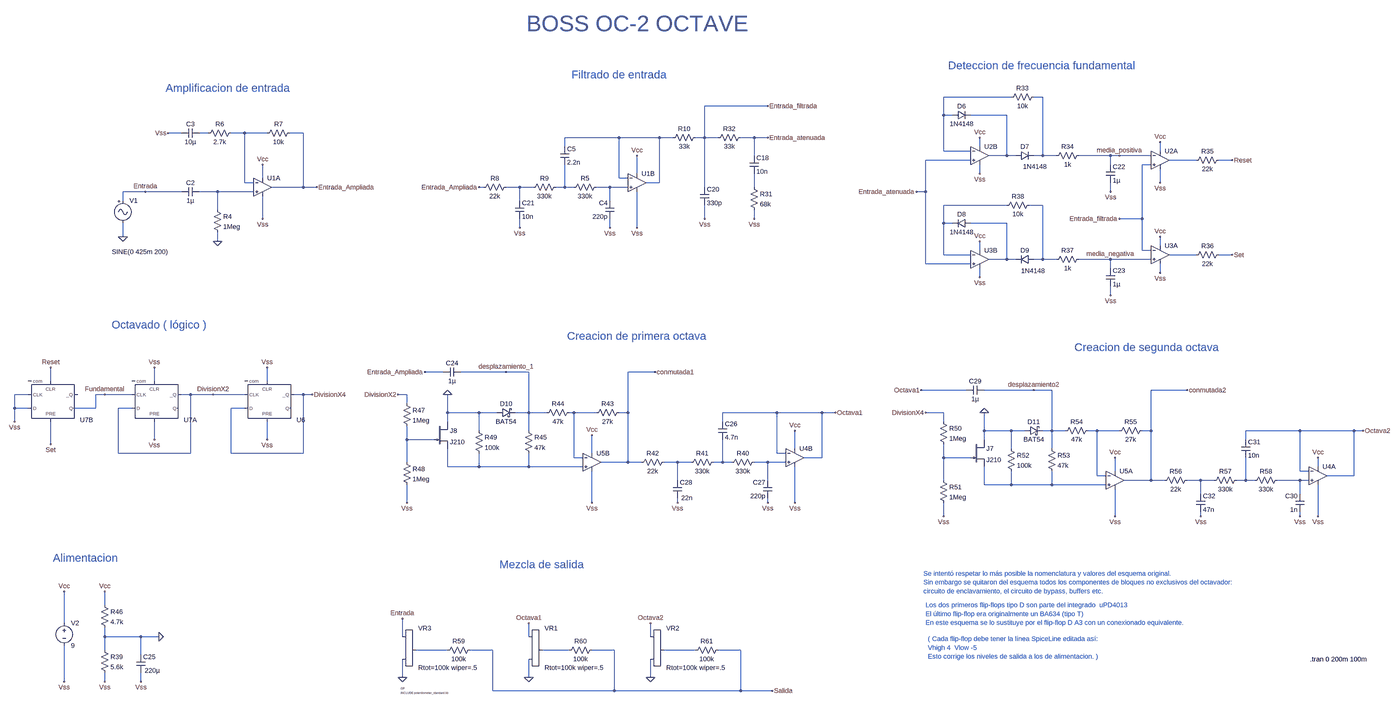
[diagram p0: schematic octavador OC2.asc, whole sheet]
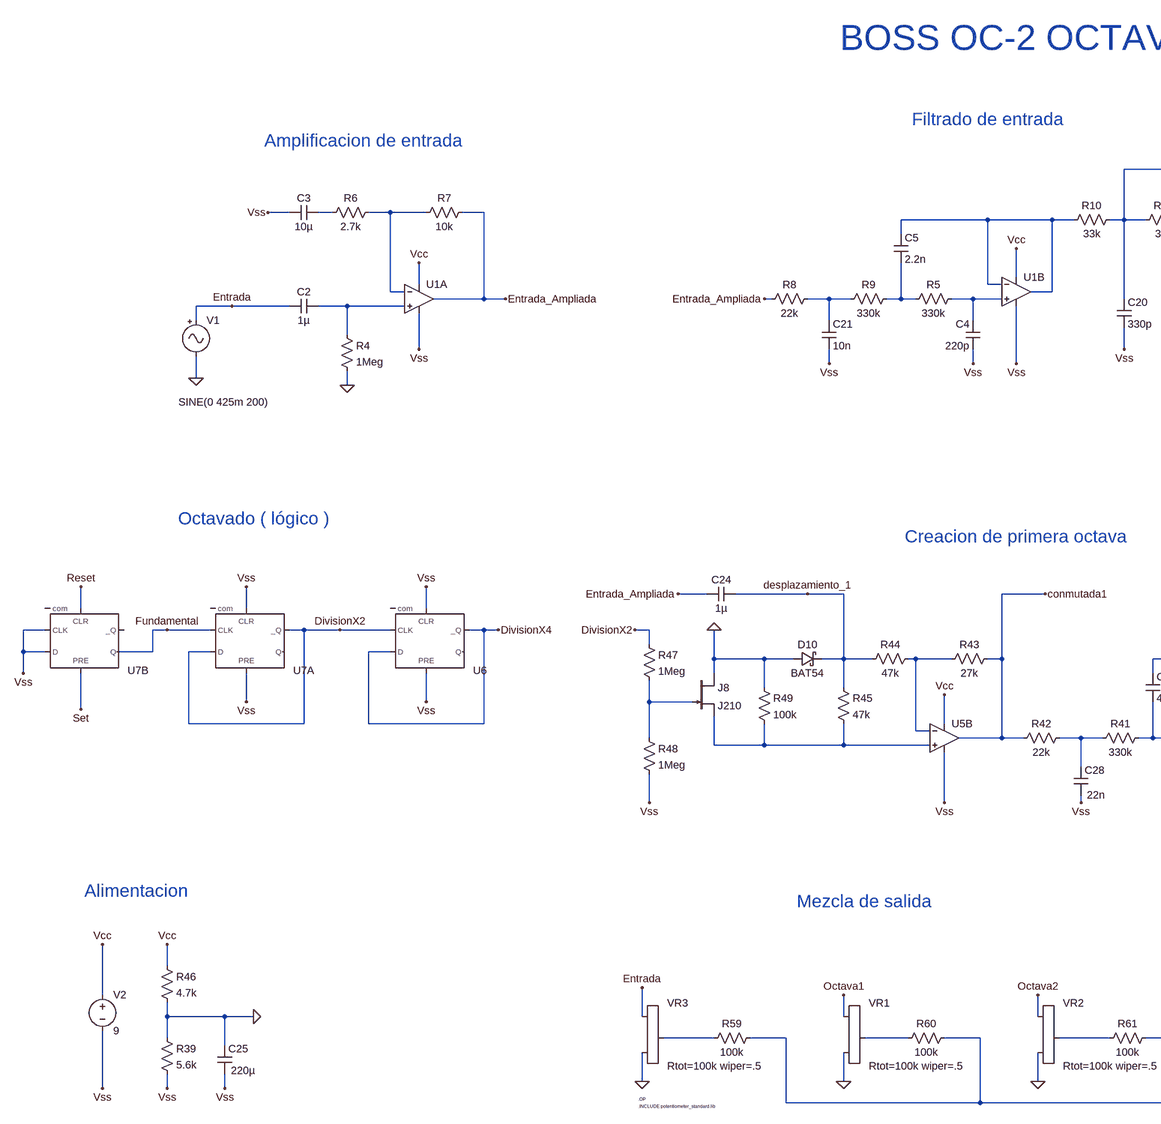
[diagram p1: schematic octavador OC2.asc, part, row 1 of 1, column 1 of 2]
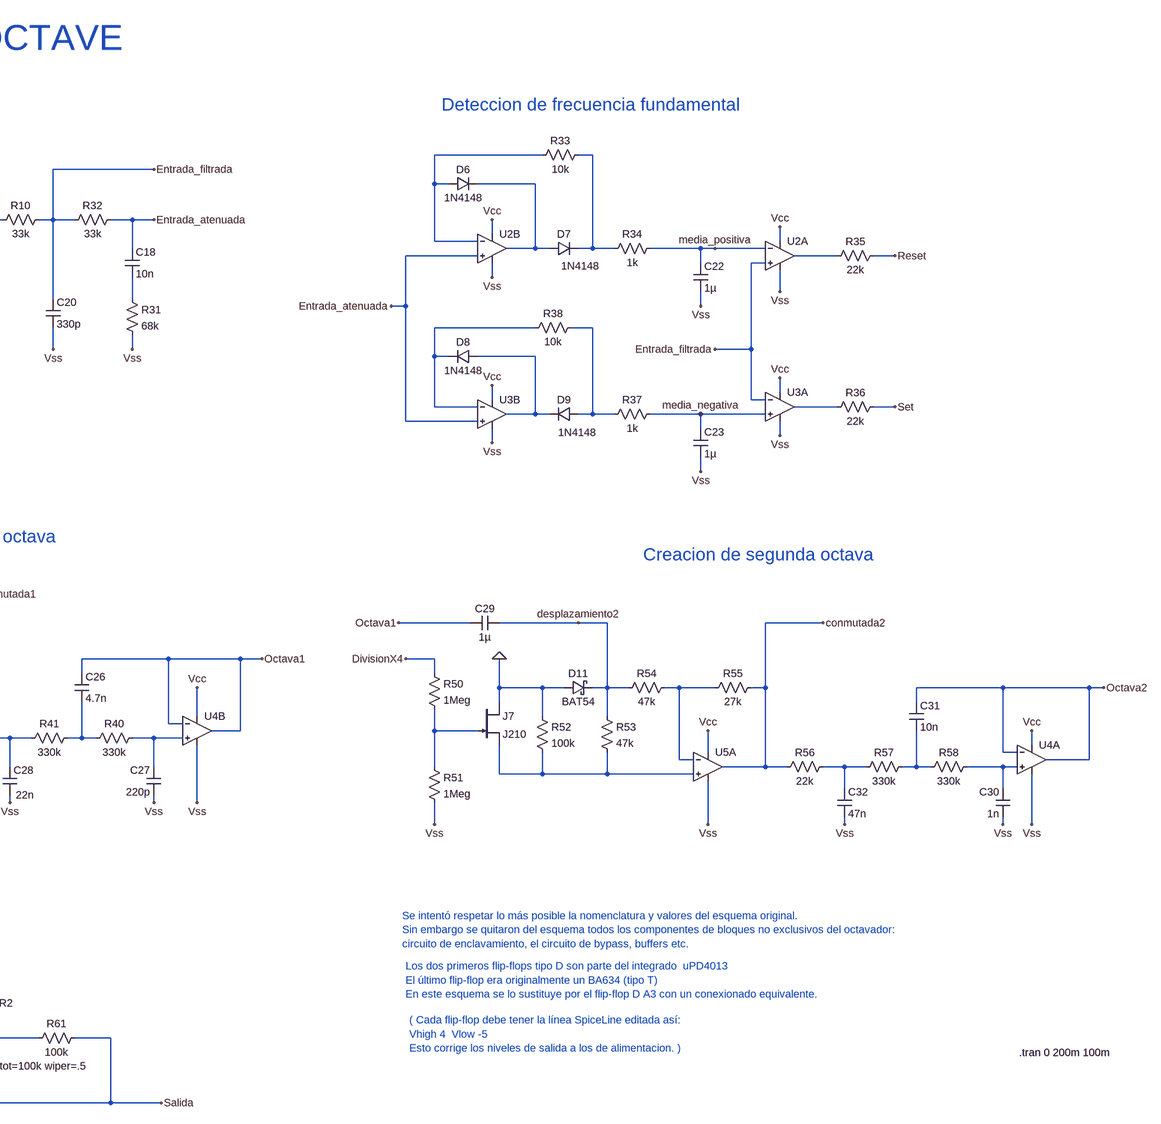
[diagram p2: schematic octavador OC2.asc, part, row 1 of 1, column 2 of 2]
octavador OC2.asc, the LTspice schematic file:
Version 4
SHEET 1 880 1368
WIRE -8048 -1760 -8288 -1760
WIRE -7936 -1760 -7968 -1760
WIRE -8912 -1728 -9136 -1728
WIRE -8288 -1696 -8288 -1760
WIRE -8256 -1696 -8288 -1696
WIRE -8064 -1696 -8192 -1696
WIRE -10992 -1632 -11040 -1632
WIRE -10896 -1632 -10928 -1632
WIRE -10768 -1632 -10816 -1632
WIRE -10688 -1632 -10768 -1632
WIRE -10560 -1632 -10608 -1632
WIRE -9440 -1616 -9632 -1616
WIRE -9296 -1616 -9440 -1616
WIRE -9248 -1616 -9296 -1616
WIRE -9136 -1616 -9136 -1728
WIRE -9136 -1616 -9168 -1616
WIRE -9088 -1616 -9136 -1616
WIRE -8960 -1616 -9008 -1616
WIRE -8912 -1616 -8960 -1616
WIRE -9632 -1584 -9632 -1616
WIRE -8160 -1584 -8160 -1616
WIRE -8288 -1568 -8288 -1696
WIRE -8192 -1568 -8288 -1568
WIRE -7520 -1568 -7520 -1600
WIRE -8960 -1552 -8960 -1616
WIRE -8064 -1552 -8064 -1696
WIRE -8064 -1552 -8128 -1552
WIRE -8032 -1552 -8064 -1552
WIRE -7936 -1552 -7936 -1760
WIRE -7936 -1552 -7968 -1552
WIRE -7888 -1552 -7936 -1552
WIRE -7696 -1552 -7808 -1552
WIRE -7664 -1552 -7696 -1552
WIRE -7552 -1552 -7664 -1552
WIRE -8192 -1536 -8352 -1536
WIRE -7392 -1536 -7488 -1536
WIRE -7264 -1536 -7312 -1536
WIRE -7696 -1520 -7696 -1552
WIRE -7552 -1520 -7584 -1520
WIRE -9376 -1488 -9376 -1552
WIRE -8160 -1488 -8160 -1520
WIRE -10704 -1472 -10704 -1520
WIRE -9440 -1472 -9440 -1616
WIRE -9408 -1472 -9440 -1472
WIRE -10768 -1456 -10768 -1632
WIRE -10736 -1456 -10768 -1456
WIRE -9296 -1456 -9296 -1616
WIRE -9296 -1456 -9344 -1456
WIRE -7520 -1456 -7520 -1504
WIRE -10560 -1440 -10560 -1632
WIRE -10560 -1440 -10672 -1440
WIRE -10512 -1440 -10560 -1440
WIRE -9920 -1440 -9936 -1440
WIRE -9792 -1440 -9840 -1440
WIRE -9744 -1440 -9792 -1440
WIRE -9632 -1440 -9632 -1520
WIRE -9632 -1440 -9664 -1440
WIRE -9600 -1440 -9632 -1440
WIRE -9472 -1440 -9520 -1440
WIRE -9408 -1440 -9472 -1440
WIRE -9136 -1440 -9136 -1616
WIRE -8960 -1440 -8960 -1488
WIRE -11120 -1424 -11200 -1424
WIRE -10992 -1424 -11120 -1424
WIRE -10864 -1424 -10928 -1424
WIRE -10736 -1424 -10864 -1424
WIRE -8352 -1424 -8352 -1536
WIRE -8352 -1424 -8384 -1424
WIRE -7696 -1424 -7696 -1456
WIRE -11200 -1392 -11200 -1424
WIRE -9792 -1392 -9792 -1440
WIRE -9472 -1392 -9472 -1440
WIRE -8064 -1376 -8288 -1376
WIRE -7936 -1376 -7984 -1376
WIRE -10864 -1360 -10864 -1424
WIRE -10704 -1328 -10704 -1408
WIRE -9136 -1328 -9136 -1376
WIRE -8960 -1328 -8960 -1360
WIRE -7584 -1328 -7584 -1520
WIRE -7584 -1328 -7664 -1328
WIRE -8288 -1312 -8288 -1376
WIRE -8256 -1312 -8288 -1312
WIRE -8064 -1312 -8192 -1312
WIRE -9792 -1296 -9792 -1328
WIRE -9472 -1296 -9472 -1328
WIRE -9376 -1296 -9376 -1424
WIRE -11200 -1264 -11200 -1312
WIRE -10864 -1248 -10864 -1280
WIRE -7520 -1232 -7520 -1264
WIRE -8160 -1216 -8160 -1248
WIRE -7584 -1216 -7584 -1328
WIRE -7552 -1216 -7584 -1216
WIRE -8288 -1200 -8288 -1312
WIRE -8192 -1200 -8288 -1200
WIRE -7392 -1200 -7488 -1200
WIRE -7264 -1200 -7312 -1200
WIRE -8064 -1184 -8064 -1312
WIRE -8064 -1184 -8128 -1184
WIRE -8032 -1184 -8064 -1184
WIRE -7936 -1184 -7936 -1376
WIRE -7936 -1184 -7968 -1184
WIRE -7888 -1184 -7936 -1184
WIRE -7696 -1184 -7808 -1184
WIRE -7552 -1184 -7696 -1184
WIRE -8352 -1168 -8352 -1424
WIRE -8192 -1168 -8352 -1168
WIRE -7696 -1152 -7696 -1184
WIRE -7520 -1136 -7520 -1168
WIRE -8160 -1120 -8160 -1152
WIRE -7696 -1056 -7696 -1088
WIRE -10064 -784 -10128 -784
WIRE -9840 -784 -10000 -784
WIRE -9760 -784 -9840 -784
WIRE -9312 -784 -9408 -784
WIRE -11456 -752 -11456 -800
WIRE -11088 -752 -11088 -800
WIRE -10688 -752 -10688 -800
WIRE -8208 -720 -8368 -720
WIRE -7968 -720 -8144 -720
WIRE -7904 -720 -7968 -720
WIRE -7424 -720 -7552 -720
WIRE -11536 -704 -11584 -704
WIRE -11264 -704 -11296 -704
WIRE -11168 -704 -11264 -704
WIRE -10960 -704 -10992 -704
WIRE -10880 -704 -10960 -704
WIRE -10768 -704 -10880 -704
WIRE -10560 -704 -10592 -704
WIRE -10528 -704 -10560 -704
WIRE -10192 -704 -10224 -704
WIRE -10192 -672 -10192 -704
WIRE -11584 -656 -11584 -704
WIRE -11536 -656 -11584 -656
WIRE -11296 -656 -11296 -704
WIRE -11296 -656 -11376 -656
WIRE -11168 -656 -11216 -656
WIRE -10768 -656 -10816 -656
WIRE -10048 -640 -10048 -704
WIRE -9936 -640 -10048 -640
WIRE -9872 -640 -9936 -640
WIRE -9760 -640 -9760 -784
WIRE -9760 -640 -9808 -640
WIRE -9696 -640 -9760 -640
WIRE -9600 -640 -9616 -640
WIRE -9520 -640 -9600 -640
WIRE -9408 -640 -9408 -784
WIRE -9408 -640 -9440 -640
WIRE -8880 -640 -9072 -640
WIRE -8720 -640 -8880 -640
WIRE -8672 -640 -8720 -640
WIRE -8288 -640 -8352 -640
WIRE -11584 -608 -11584 -656
WIRE -10048 -608 -10048 -640
WIRE -9072 -608 -9072 -640
WIRE -8288 -608 -8288 -640
WIRE -9936 -576 -9936 -640
WIRE -9760 -576 -9760 -640
WIRE -8144 -576 -8144 -640
WIRE -8048 -576 -8144 -576
WIRE -8000 -576 -8048 -576
WIRE -7904 -576 -7904 -720
WIRE -7904 -576 -7936 -576
WIRE -7856 -576 -7904 -576
WIRE -7744 -576 -7776 -576
WIRE -7664 -576 -7744 -576
WIRE -7552 -576 -7552 -720
WIRE -7552 -576 -7584 -576
WIRE -7024 -576 -7216 -576
WIRE -6832 -576 -7024 -576
WIRE -6800 -576 -6832 -576
WIRE -11088 -544 -11088 -608
WIRE -10688 -544 -10688 -608
WIRE -10192 -544 -10192 -592
WIRE -10096 -544 -10192 -544
WIRE -8144 -544 -8144 -576
WIRE -7216 -544 -7216 -576
WIRE -11456 -528 -11456 -608
WIRE -8816 -512 -8816 -576
WIRE -8048 -512 -8048 -576
WIRE -7904 -512 -7904 -576
WIRE -11216 -496 -11216 -656
WIRE -10960 -496 -10960 -704
WIRE -10960 -496 -11216 -496
WIRE -10816 -496 -10816 -656
WIRE -10560 -496 -10560 -704
WIRE -10560 -496 -10816 -496
WIRE -9536 -496 -9536 -560
WIRE -8880 -496 -8880 -640
WIRE -8848 -496 -8880 -496
WIRE -9600 -480 -9600 -640
WIRE -9568 -480 -9600 -480
WIRE -8720 -480 -8720 -640
WIRE -8720 -480 -8784 -480
WIRE -8288 -480 -8288 -528
WIRE -8192 -480 -8288 -480
WIRE -10192 -464 -10192 -544
WIRE -9408 -464 -9408 -640
WIRE -9408 -464 -9504 -464
WIRE -9360 -464 -9408 -464
WIRE -9232 -464 -9280 -464
WIRE -9184 -464 -9232 -464
WIRE -9072 -464 -9072 -544
WIRE -9072 -464 -9104 -464
WIRE -9040 -464 -9072 -464
WIRE -8912 -464 -8960 -464
WIRE -8848 -464 -8912 -464
WIRE -10048 -448 -10048 -512
WIRE -9936 -448 -9936 -496
WIRE -9936 -448 -10048 -448
WIRE -9760 -448 -9760 -496
WIRE -9760 -448 -9936 -448
WIRE -9568 -448 -9760 -448
WIRE -6960 -448 -6960 -480
WIRE -7680 -432 -7680 -480
WIRE -7024 -432 -7024 -576
WIRE -6992 -432 -7024 -432
WIRE -7744 -416 -7744 -576
WIRE -7712 -416 -7744 -416
WIRE -6832 -416 -6832 -576
WIRE -6832 -416 -6928 -416
WIRE -9232 -400 -9232 -464
WIRE -8912 -400 -8912 -464
WIRE -8288 -400 -8288 -480
WIRE -7552 -400 -7552 -576
WIRE -7552 -400 -7648 -400
WIRE -7504 -400 -7552 -400
WIRE -7376 -400 -7424 -400
WIRE -7328 -400 -7376 -400
WIRE -7216 -400 -7216 -480
WIRE -7216 -400 -7248 -400
WIRE -7184 -400 -7216 -400
WIRE -7024 -400 -7104 -400
WIRE -6992 -400 -7024 -400
WIRE -8144 -384 -8144 -448
WIRE -8048 -384 -8048 -432
WIRE -8048 -384 -8144 -384
WIRE -7904 -384 -7904 -432
WIRE -7904 -384 -8048 -384
WIRE -7712 -384 -7904 -384
WIRE -7376 -352 -7376 -400
WIRE -7024 -352 -7024 -400
WIRE -10192 -320 -10192 -384
WIRE -9536 -320 -9536 -432
WIRE -9232 -320 -9232 -336
WIRE -8912 -320 -8912 -336
WIRE -8816 -320 -8816 -448
WIRE -8288 -272 -8288 -320
WIRE -7680 -272 -7680 -368
WIRE -7376 -272 -7376 -288
WIRE -7024 -272 -7024 -288
WIRE -6960 -272 -6960 -384
WIRE -11264 208 -11264 160
WIRE -11408 272 -11408 160
WIRE -11264 320 -11264 288
WIRE -11136 320 -11264 320
WIRE -11072 320 -11136 320
WIRE -10208 320 -10208 256
WIRE -9760 320 -9760 272
WIRE -9328 320 -9328 272
WIRE -11264 368 -11264 320
WIRE -10048 368 -10160 368
WIRE -9888 368 -9968 368
WIRE -9616 368 -9712 368
WIRE -9456 368 -9536 368
WIRE -9168 368 -9280 368
WIRE -9008 368 -9088 368
WIRE -11136 384 -11136 320
WIRE -10208 464 -10208 400
WIRE -9760 464 -9760 400
WIRE -9328 464 -9328 400
WIRE -11408 480 -11408 352
WIRE -11264 480 -11264 448
WIRE -11136 480 -11136 448
WIRE -9888 512 -9888 368
WIRE -9456 512 -9456 368
WIRE -9456 512 -9888 512
WIRE -9008 512 -9008 368
WIRE -9008 512 -9456 512
WIRE -8896 512 -9008 512
FLAG -7520 -1136 Vss
FLAG -11408 160 Vcc
FLAG -8160 -1616 Vcc
FLAG -7520 -1600 Vcc
FLAG -8160 -1248 Vcc
FLAG -7520 -1264 Vcc
FLAG -7696 -1184 media_negativa
FLAG -7664 -1552 media_positiva
FLAG -11456 -528 Set
FLAG -11456 -800 Reset
FLAG -11264 -704 Fundamental
FLAG -10880 -704 DivisionX2
FLAG -7664 -1328 Entrada_filtrada
FLAG -9536 -560 Vcc
FLAG -9840 -784 desplazamiento_1
FLAG -9312 -784 conmutada1
FLAG -10224 -704 DivisionX2
FLAG -8816 -576 Vcc
FLAG -8672 -640 Octava1
FLAG -10528 -704 DivisionX4
FLAG -7680 -480 Vcc
FLAG -7968 -720 desplazamiento2
FLAG -7424 -720 conmutada2
FLAG -8352 -640 DivisionX4
FLAG -6960 -480 Vcc
FLAG -6800 -576 Octava2
FLAG -9376 -1552 Vcc
FLAG -9936 -1440 Entrada_Ampliada
FLAG -11408 480 Vss
FLAG -11072 320 0
FLAG -10192 -320 Vss
FLAG -9536 -320 Vss
FLAG -9232 -320 Vss
FLAG -8912 -320 Vss
FLAG -8816 -320 Vss
FLAG -8288 -272 Vss
FLAG -7680 -272 Vss
FLAG -7376 -272 Vss
FLAG -7024 -272 Vss
FLAG -6960 -272 Vss
FLAG -7696 -1056 Vss
FLAG -8960 -1328 Vss
FLAG -9136 -1328 Vss
FLAG -9472 -1296 Vss
FLAG -9376 -1296 Vss
FLAG -9792 -1296 Vss
FLAG -8160 -1120 Vss
FLAG -8160 -1488 Vss
FLAG -7696 -1424 Vss
FLAG -7520 -1456 Vss
FLAG -11584 -608 Vss
FLAG -11088 -544 Vss
FLAG -10688 -544 Vss
FLAG -10688 -800 Vss
FLAG -11088 -800 Vss
FLAG -10048 -704 0
FLAG -11200 -1264 0
FLAG -8144 -640 0
FLAG -8384 -1424 Entrada_atenuada
FLAG -10208 464 0
FLAG -9760 464 0
FLAG -9328 464 0
FLAG -9760 272 Octava1
FLAG -10208 256 Entrada
FLAG -9328 272 Octava2
FLAG -8896 512 Salida
FLAG -10704 -1328 Vss
FLAG -10704 -1520 Vcc
FLAG -10864 -1248 0
FLAG -11040 -1632 Vss
FLAG -10512 -1440 Entrada_Ampliada
FLAG -11120 -1424 Entrada
FLAG -10128 -784 Entrada_Ampliada
FLAG -8912 -1728 Entrada_filtrada
FLAG -11264 480 Vss
FLAG -11136 480 Vss
FLAG -11264 160 Vcc
FLAG -8912 -1616 Entrada_atenuada
FLAG -7264 -1200 Set
FLAG -7264 -1536 Reset
FLAG -8368 -720 Octava1
SYMBOL Digital\\dflop -11456 -608 M180
SYMATTR InstName U7B
SYMATTR SpiceLine Vhigh 4  Vlow -5
SYMBOL Digital\\dflop -11088 -608 M180
SYMATTR InstName U7A
SYMATTR SpiceLine Vhigh 4  Vlow -5
SYMBOL Misc\\signal -11200 -1408 R0
WINDOW 123 0 0 Left 0
WINDOW 39 0 0 Left 0
WINDOW 3 -39 197 Left 2
SYMATTR Value SINE(0 425m 200)
SYMATTR InstName V1
SYMBOL res -7904 -1536 R270
WINDOW 0 32 56 VTop 2
WINDOW 3 0 56 VBottom 2
SYMATTR InstName R34
SYMATTR Value 1k
SYMBOL voltage -11408 256 R0
WINDOW 123 0 0 Left 0
WINDOW 39 0 0 Left 0
SYMATTR InstName V2
SYMATTR Value 9
SYMBOL diode -8032 -1536 R270
WINDOW 0 32 32 VTop 2
WINDOW 3 -7 68 VBottom 2
SYMATTR InstName D7
SYMATTR Value 1N4148
SYMBOL diode -8256 -1680 R270
WINDOW 0 32 32 VTop 2
WINDOW 3 0 32 VBottom 2
SYMATTR InstName D6
SYMATTR Value 1N4148
SYMBOL diode -7968 -1200 R90
WINDOW 0 0 32 VBottom 2
WINDOW 3 41 3 VTop 2
SYMATTR InstName D9
SYMATTR Value 1N4148
SYMBOL diode -8192 -1328 R90
WINDOW 0 0 32 VBottom 2
WINDOW 3 32 32 VTop 2
SYMATTR InstName D8
SYMATTR Value 1N4148
SYMBOL cap -7712 -1520 R0
SYMATTR InstName C22
SYMATTR Value 1µ
SYMBOL cap -7712 -1152 R0
SYMATTR InstName C23
SYMATTR Value 1µ
SYMBOL res -8064 -1744 R270
WINDOW 0 32 56 VTop 2
WINDOW 3 0 56 VBottom 2
SYMATTR InstName R33
SYMATTR Value 10k
SYMBOL res -7904 -1168 R270
WINDOW 0 32 56 VTop 2
WINDOW 3 0 56 VBottom 2
SYMATTR InstName R37
SYMATTR Value 1k
SYMBOL res -8080 -1360 R270
WINDOW 0 32 56 VTop 2
WINDOW 3 0 56 VBottom 2
SYMATTR InstName R38
SYMATTR Value 10k
SYMBOL njf -10096 -608 R0
SYMATTR InstName J8
SYMATTR Value J210
SYMBOL res -10208 -688 R0
SYMATTR InstName R47
SYMATTR Value 1Meg
SYMBOL res -10208 -480 R0
SYMATTR InstName R48
SYMATTR Value 1Meg
SYMBOL res -9952 -592 R0
SYMATTR InstName R49
SYMATTR Value 100k
SYMBOL schottky -9872 -624 R270
WINDOW 0 32 32 VTop 2
WINDOW 3 0 32 VBottom 2
SYMATTR InstName D10
SYMATTR Value BAT54
SYMATTR Description Diode
SYMATTR Type diode
SYMBOL res -9776 -592 R0
SYMATTR InstName R45
SYMATTR Value 47k
SYMBOL cap -10000 -800 R90
WINDOW 3 32 32 VTop 2
WINDOW 0 0 32 VBottom 2
SYMATTR Value 1µ
SYMATTR InstName C24
SYMBOL res -9712 -624 R270
WINDOW 0 32 56 VTop 2
WINDOW 3 0 56 VBottom 2
SYMATTR InstName R44
SYMATTR Value 47k
SYMBOL res -9536 -624 R270
WINDOW 0 32 56 VTop 2
WINDOW 3 0 56 VBottom 2
SYMATTR InstName R43
SYMATTR Value 27k
SYMBOL res -9376 -448 R270
WINDOW 0 32 56 VTop 2
WINDOW 3 0 56 VBottom 2
SYMATTR InstName R42
SYMATTR Value 22k
SYMBOL res -9200 -448 R270
WINDOW 0 32 56 VTop 2
WINDOW 3 0 56 VBottom 2
SYMATTR InstName R41
SYMATTR Value 330k
SYMBOL res -9056 -448 R270
WINDOW 0 32 56 VTop 2
WINDOW 3 0 56 VBottom 2
SYMATTR InstName R40
SYMATTR Value 330k
SYMBOL cap -9248 -400 R0
WINDOW 3 29 63 Left 2
SYMATTR Value 22n
SYMATTR InstName C28
SYMBOL cap -9088 -608 R0
SYMATTR InstName C26
SYMATTR Value 4.7n
SYMBOL cap -8896 -336 R180
WINDOW 0 24 56 Left 2
WINDOW 3 24 8 Left 2
SYMATTR InstName C27
SYMATTR Value 220p
SYMBOL Digital\\dflop -10688 -608 M180
SYMATTR InstName U6
SYMATTR SpiceLine Vhigh 4  Vlow -5
SYMBOL njf -8192 -544 R0
SYMATTR InstName J7
SYMATTR Value J210
SYMBOL res -8304 -624 R0
SYMATTR InstName R50
SYMATTR Value 1Meg
SYMBOL res -8304 -416 R0
SYMATTR InstName R51
SYMATTR Value 1Meg
SYMBOL res -8064 -528 R0
SYMATTR InstName R52
SYMATTR Value 100k
SYMBOL schottky -8000 -560 R270
WINDOW 0 32 32 VTop 2
WINDOW 3 0 32 VBottom 2
SYMATTR InstName D11
SYMATTR Value BAT54
SYMATTR Description Diode
SYMATTR Type diode
SYMBOL res -7920 -528 R0
SYMATTR InstName R53
SYMATTR Value 47k
SYMBOL res -7872 -560 R270
WINDOW 0 32 56 VTop 2
WINDOW 3 0 56 VBottom 2
SYMATTR InstName R54
SYMATTR Value 47k
SYMBOL res -7680 -560 R270
WINDOW 0 32 56 VTop 2
WINDOW 3 0 56 VBottom 2
SYMATTR InstName R55
SYMATTR Value 27k
SYMBOL res -7520 -384 R270
WINDOW 0 32 56 VTop 2
WINDOW 3 0 56 VBottom 2
SYMATTR InstName R56
SYMATTR Value 22k
SYMBOL res -7344 -384 R270
WINDOW 0 32 56 VTop 2
WINDOW 3 0 56 VBottom 2
SYMATTR InstName R57
SYMATTR Value 330k
SYMBOL res -7200 -384 R270
WINDOW 0 32 56 VTop 2
WINDOW 3 0 56 VBottom 2
SYMATTR InstName R58
SYMATTR Value 330k
SYMBOL cap -7392 -352 R0
SYMATTR InstName C32
SYMATTR Value 47n
SYMBOL cap -7232 -544 R0
SYMATTR InstName C31
SYMATTR Value 10n
SYMBOL cap -7008 -288 R180
WINDOW 0 24 56 Left 2
WINDOW 3 24 8 Left 2
SYMATTR InstName C30
SYMATTR Value 1n
SYMBOL cap -8208 -704 R270
WINDOW 0 32 32 VTop 2
WINDOW 3 0 32 VBottom 2
SYMATTR InstName C29
SYMATTR Value 1µ
SYMBOL res -9936 -1424 R270
WINDOW 0 32 56 VTop 2
WINDOW 3 0 56 VBottom 2
SYMATTR InstName R8
SYMATTR Value 22k
SYMBOL res -9760 -1424 R270
WINDOW 0 32 56 VTop 2
WINDOW 3 0 56 VBottom 2
SYMATTR InstName R9
SYMATTR Value 330k
SYMBOL res -9616 -1424 R270
WINDOW 0 32 56 VTop 2
WINDOW 3 0 56 VBottom 2
SYMATTR InstName R5
SYMATTR Value 330k
SYMBOL cap -9808 -1392 R0
SYMATTR InstName C21
SYMATTR Value 10n
SYMBOL cap -9648 -1584 R0
SYMATTR InstName C5
SYMATTR Value 2.2n
SYMBOL cap -9456 -1328 R180
WINDOW 0 24 56 Left 2
WINDOW 3 24 8 Left 2
SYMATTR InstName C4
SYMATTR Value 220p
SYMBOL res -9264 -1600 R270
WINDOW 0 32 56 VTop 2
WINDOW 3 0 56 VBottom 2
SYMATTR InstName R10
SYMATTR Value 33k
SYMBOL res -9104 -1600 R270
WINDOW 0 32 56 VTop 2
WINDOW 3 0 56 VBottom 2
SYMATTR InstName R32
SYMATTR Value 33k
SYMBOL cap -9152 -1440 R0
SYMATTR InstName C20
SYMATTR Value 330p
SYMBOL cap -8976 -1552 R0
SYMATTR InstName C18
SYMATTR Value 10n
SYMBOL res -8976 -1456 R0
SYMATTR InstName R31
SYMATTR Value 68k
SYMBOL potentiometer_standard -10224 304 R0
SYMATTR InstName VR3
SYMATTR Value Rtot=100k wiper=.5
SYMATTR SpiceLine Rtap=20k  tap=0.5
SYMATTR SpiceModel pot_pow
SYMBOL potentiometer_standard -9776 304 R0
SYMATTR InstName VR1
SYMATTR Value Rtot=100k wiper=.5
SYMATTR SpiceLine Rtap=20k tap=0.5
SYMATTR SpiceModel pot_pow
SYMBOL potentiometer_standard -9344 304 R0
SYMATTR InstName VR2
SYMATTR Value Rtot=100k wiper=.5
SYMATTR SpiceLine Rtap=20k  tap=0.5
SYMATTR SpiceModel pot_pow
SYMBOL res -10064 384 R270
WINDOW 0 32 56 VTop 2
WINDOW 3 0 56 VBottom 2
SYMATTR InstName R59
SYMATTR Value 100k
SYMBOL res -9632 384 R270
WINDOW 0 32 56 VTop 2
WINDOW 3 0 56 VBottom 2
SYMATTR InstName R60
SYMATTR Value 100k
SYMBOL res -9184 384 R270
WINDOW 0 32 56 VTop 2
WINDOW 3 0 56 VBottom 2
SYMATTR InstName R61
SYMATTR Value 100k
SYMBOL cap -10992 -1616 R270
WINDOW 0 32 32 VTop 2
WINDOW 3 0 32 VBottom 2
SYMATTR InstName C3
SYMATTR Value 10µ
SYMBOL cap -10992 -1408 R270
WINDOW 0 32 32 VTop 2
WINDOW 3 0 32 VBottom 2
SYMATTR InstName C2
SYMATTR Value 1µ
SYMBOL res -10912 -1616 R270
WINDOW 0 32 56 VTop 2
WINDOW 3 0 56 VBottom 2
SYMATTR InstName R6
SYMATTR Value 2.7k
SYMBOL res -10704 -1616 R270
WINDOW 0 32 56 VTop 2
WINDOW 3 0 56 VBottom 2
SYMATTR InstName R7
SYMATTR Value 10k
SYMBOL res -10880 -1376 R0
SYMATTR InstName R4
SYMATTR Value 1Meg
SYMBOL res -11280 352 R0
SYMATTR InstName R39
SYMATTR Value 5.6k
SYMBOL res -11280 192 R0
SYMATTR InstName R46
SYMATTR Value 4.7k
SYMBOL cap -11152 384 R0
WINDOW 3 30 56 Left 2
SYMATTR Value 220µ
SYMATTR InstName C25
SYMBOL res -7408 -1184 R270
WINDOW 0 32 56 VTop 2
WINDOW 3 0 56 VBottom 2
SYMATTR InstName R36
SYMATTR Value 22k
SYMBOL res -7408 -1520 R270
WINDOW 0 32 56 VTop 2
WINDOW 3 0 56 VBottom 2
SYMATTR InstName R35
SYMATTR Value 22k
SYMBOL OpAmps\\UniversalOpAmp2 -9536 -464 R0
SYMATTR InstName U5B
SYMATTR Value2 Avol=1Meg GBW=500k Slew=0.5Meg
SYMBOL OpAmps\\UniversalOpAmp2 -9376 -1456 R0
SYMATTR InstName U1B
SYMATTR Value2 Avol=1Meg GBW=500k Slew=0.5Meg
SYMBOL OpAmps\\UniversalOpAmp2 -8160 -1184 R0
SYMATTR InstName U3B
SYMATTR Value2 Avol=1Meg GBW=500k Slew=0.5Meg
SYMBOL OpAmps\\UniversalOpAmp2 -8160 -1552 R0
SYMATTR InstName U2B
SYMATTR Value2 Avol=1Meg GBW=500k Slew=0.5Meg
SYMBOL OpAmps\\UniversalOpAmp2 -7520 -1200 R0
SYMATTR InstName U3A
SYMATTR Value2 Avol=1Meg GBW=500k Slew=0.5Meg
SYMBOL OpAmps\\UniversalOpAmp2 -7520 -1536 R0
SYMATTR InstName U2A
SYMATTR Value2 Avol=1Meg GBW=500k Slew=0.5Meg
SYMBOL OpAmps\\UniversalOpAmp2 -7680 -400 R0
SYMATTR InstName U5A
SYMATTR Value2 Avol=1Meg GBW=500k Slew=0.5Meg
SYMBOL OpAmps\\UniversalOpAmp2 -6960 -416 R0
SYMATTR InstName U4A
SYMATTR Value2 Avol=1Meg GBW=500k Slew=0.5Meg
SYMBOL OpAmps\\UniversalOpAmp2 -8816 -480 R0
SYMATTR InstName U4B
SYMATTR Value2 Avol=1Meg GBW=500k Slew=0.5Meg
SYMBOL OpAmps\\UniversalOpAmp2 -10704 -1440 R0
SYMATTR InstName U1A
SYMATTR Value2 Avol=1Meg GBW=500k Slew=0.5Meg
TEXT -6784 400 Right 2 !.tran 0 200m 100m
TEXT -8344 328 Left 2 ;( Cada flip-flop debe tener la línea SpiceLine editada así:\nVhigh 4  Vlow -5\nEsto corrige los niveles de salida a los de alimentacion. )
TEXT -10216 520 Left 0 !.INCLUDE potentiometer_standard.lib
TEXT -8352 208 Left 2 ;Los dos primeros flip-flops tipo D son parte del integrado  uPD4013\nEl último flip-flop era originalmente un BA634 (tipo T)\nEn este esquema se lo sustituye por el flip-flop D A3 con un conexionado equivalente.
TEXT -9768 -2072 Left 6 ;BOSS OC-2 OCTAVE
TEXT -8360 96 Left 2 ;Se intentó respetar lo más posible la nomenclatura y valores del esquema original.\nSin embargo se quitaron del esquema todos los componentes de bloques no exclusivos del octavador:\ncircuito de enclavamiento, el circuito de bypass, buffers etc.
TEXT -9864 64 Left 4 ;Mezcla de salida
TEXT -11048 -1792 Left 4 ;Amplificacion de entrada
TEXT -9624 -912 Left 4 ;Creacion de primera octava
TEXT -7824 -872 Left 4 ;Creacion de segunda octava
TEXT -11240 -952 Left 4 ;Octavado ( lógico )
TEXT -9608 -1840 Left 4 ;Filtrado de entrada
TEXT -8272 -1872 Left 4 ;Deteccion de frecuencia fundamental
TEXT -11448 40 Left 4 ;Alimentacion
TEXT -10216 504 Left 0 !.OP

The netlist it stands for:
* octavador OC2.asc
A§U7B Vss 0 Vss Set Reset 0 Fundamental 0 DFLOP Vhigh 4  Vlow -5
A§U7A DivisionX2 0 Fundamental Vss Vss DivisionX2 0 0 DFLOP Vhigh 4  Vlow -5
V1 Entrada 0 SINE(0 425m 200)
R34 N002 media_positiva 1k
V2 Vcc Vss 9
D7 N003 N002 1N4148
D6 N001 N003 1N4148
D9 N014 N015 1N4148
D8 N015 N013 1N4148
C22 media_positiva Vss 1µ
C23 media_negativa Vss 1µ
R33 N001 N002 10k
R37 N014 media_negativa 1k
R38 N013 N014 10k
J8 0 N019 N024 J210
R47 DivisionX2 N019 1Meg
R48 N019 Vss 1Meg
R49 0 N024 100k
D10 0 desplazamiento_1 BAT54
R45 desplazamiento_1 N024 47k
C24 desplazamiento_1 Entrada_Ampliada 1µ
R44 desplazamiento_1 N017 47k
R43 N017 conmutada1 27k
R42 conmutada1 N021 22k
R41 N021 N022 330k
R40 N022 N023 330k
C28 N021 Vss 22n
C26 Octava1 N022 4.7n
C27 Vss N023 220p
A§U6 DivisionX4 0 DivisionX2 Vss Vss DivisionX4 0 0 DFLOP Vhigh 4  Vlow -5
J7 0 N020 N028 J210
R50 DivisionX4 N020 1Meg
R51 N020 Vss 1Meg
R52 0 N028 100k
D11 0 desplazamiento2 BAT54
R53 desplazamiento2 N028 47k
R54 desplazamiento2 N018 47k
R55 N018 conmutada2 27k
R56 conmutada2 N025 22k
R57 N025 N026 330k
R58 N026 N027 330k
C32 N025 Vss 47n
C31 Octava2 N026 10n
C30 Vss N027 1n
C29 Octava1 desplazamiento2 1µ
R8 Entrada_Ampliada N008 22k
R9 N008 N009 330k
R5 N009 N010 330k
C21 N008 Vss 10n
C5 N006 N009 2.2n
C4 Vss N010 220p
R10 N006 Entrada_filtrada 33k
R32 Entrada_filtrada Entrada_atenuada 33k
C20 Entrada_filtrada Vss 330p
C18 Entrada_atenuada N011 10n
R31 N011 Vss 68k
XVR3 Entrada 0 N029 pot_pow Rtot=100k wiper=.5 Rtap=20k  tap=0.5
XVR1 Octava1 0 N030 pot_pow Rtot=100k wiper=.5 Rtap=20k tap=0.5
XVR2 Octava2 0 N031 pot_pow Rtot=100k wiper=.5 Rtap=20k  tap=0.5
R59 N029 Salida 100k
R60 N030 Salida 100k
R61 N031 Salida 100k
C3 Vss N004 10µ
C2 Entrada N012 1µ
R6 N004 N005 2.7k
R7 N005 Entrada_Ampliada 10k
R4 N012 0 1Meg
R39 0 Vss 5.6k
R46 Vcc 0 4.7k
C25 0 Vss 220µ
R36 N016 Set 22k
R35 N007 Reset 22k
XU5B N024 N017 Vcc Vss conmutada1 level2 Avol=1Meg GBW=500k Slew=0.5Meg Ilimit=25m Rail=0 Vos=0 En=0 Enk=0 In=0 Ink=0 Rin=500Meg  ; pins In+ In- V+ V- OUT
XU1B N010 N006 Vcc Vss N006 level2 Avol=1Meg GBW=500k Slew=0.5Meg Ilimit=25m Rail=0 Vos=0 En=0 Enk=0 In=0 Ink=0 Rin=500Meg  ; pins In+ In- V+ V- OUT
XU3B Entrada_atenuada N013 Vcc Vss N015 level2 Avol=1Meg GBW=500k Slew=0.5Meg Ilimit=25m Rail=0 Vos=0 En=0 Enk=0 In=0 Ink=0 Rin=500Meg  ; pins In+ In- V+ V- OUT
XU2B Entrada_atenuada N001 Vcc Vss N003 level2 Avol=1Meg GBW=500k Slew=0.5Meg Ilimit=25m Rail=0 Vos=0 En=0 Enk=0 In=0 Ink=0 Rin=500Meg  ; pins In+ In- V+ V- OUT
XU3A media_negativa Entrada_filtrada Vcc Vss N016 level2 Avol=1Meg GBW=500k Slew=0.5Meg Ilimit=25m Rail=0 Vos=0 En=0 Enk=0 In=0 Ink=0 Rin=500Meg  ; pins In+ In- V+ V- OUT
XU2A Entrada_filtrada media_positiva Vcc Vss N007 level2 Avol=1Meg GBW=500k Slew=0.5Meg Ilimit=25m Rail=0 Vos=0 En=0 Enk=0 In=0 Ink=0 Rin=500Meg  ; pins In+ In- V+ V- OUT
XU5A N028 N018 Vcc Vss conmutada2 level2 Avol=1Meg GBW=500k Slew=0.5Meg Ilimit=25m Rail=0 Vos=0 En=0 Enk=0 In=0 Ink=0 Rin=500Meg  ; pins In+ In- V+ V- OUT
XU4A N027 Octava2 Vcc Vss Octava2 level2 Avol=1Meg GBW=500k Slew=0.5Meg Ilimit=25m Rail=0 Vos=0 En=0 Enk=0 In=0 Ink=0 Rin=500Meg  ; pins In+ In- V+ V- OUT
XU4B N023 Octava1 Vcc Vss Octava1 level2 Avol=1Meg GBW=500k Slew=0.5Meg Ilimit=25m Rail=0 Vos=0 En=0 Enk=0 In=0 Ink=0 Rin=500Meg  ; pins In+ In- V+ V- OUT
XU1A N012 N005 Vcc Vss Entrada_Ampliada level2 Avol=1Meg GBW=500k Slew=0.5Meg Ilimit=25m Rail=0 Vos=0 En=0 Enk=0 In=0 Ink=0 Rin=500Meg  ; pins In+ In- V+ V- OUT
.model D D
.lib standard.dio
.model NJF NJF
.model PJF PJF
.lib standard.jft
.tran 0 200m 100m
* ( Cada flip-flop debe tener la línea SpiceLine editada así:
* Vhigh 4  Vlow -5
* Esto corrige los niveles de salida a los de alimentacion. )
.INCLUDE potentiometer_standard.lib
* Los dos primeros flip-flops tipo D son parte del integrado  uPD4013
* El último flip-flop era originalmente un BA634 (tipo T)
* En este esquema se lo sustituye por el flip-flop D A3 con un conexionado equivalente.
* BOSS OC-2 OCTAVE
* Se intentó respetar lo más posible la nomenclatura y valores del esquema original.
* Sin embargo se quitaron del esquema todos los componentes de bloques no exclusivos del octavador:
* circuito de enclavamiento, el circuito de bypass, buffers etc.
* Mezcla de salida
* Amplificacion de entrada
* Creacion de primera octava
* Creacion de segunda octava
* Octavado ( lógico )
* Filtrado de entrada
* Deteccion de frecuencia fundamental
* Alimentacion
.OP
.lib UniversalOpAmp2.lib
.backanno
.end